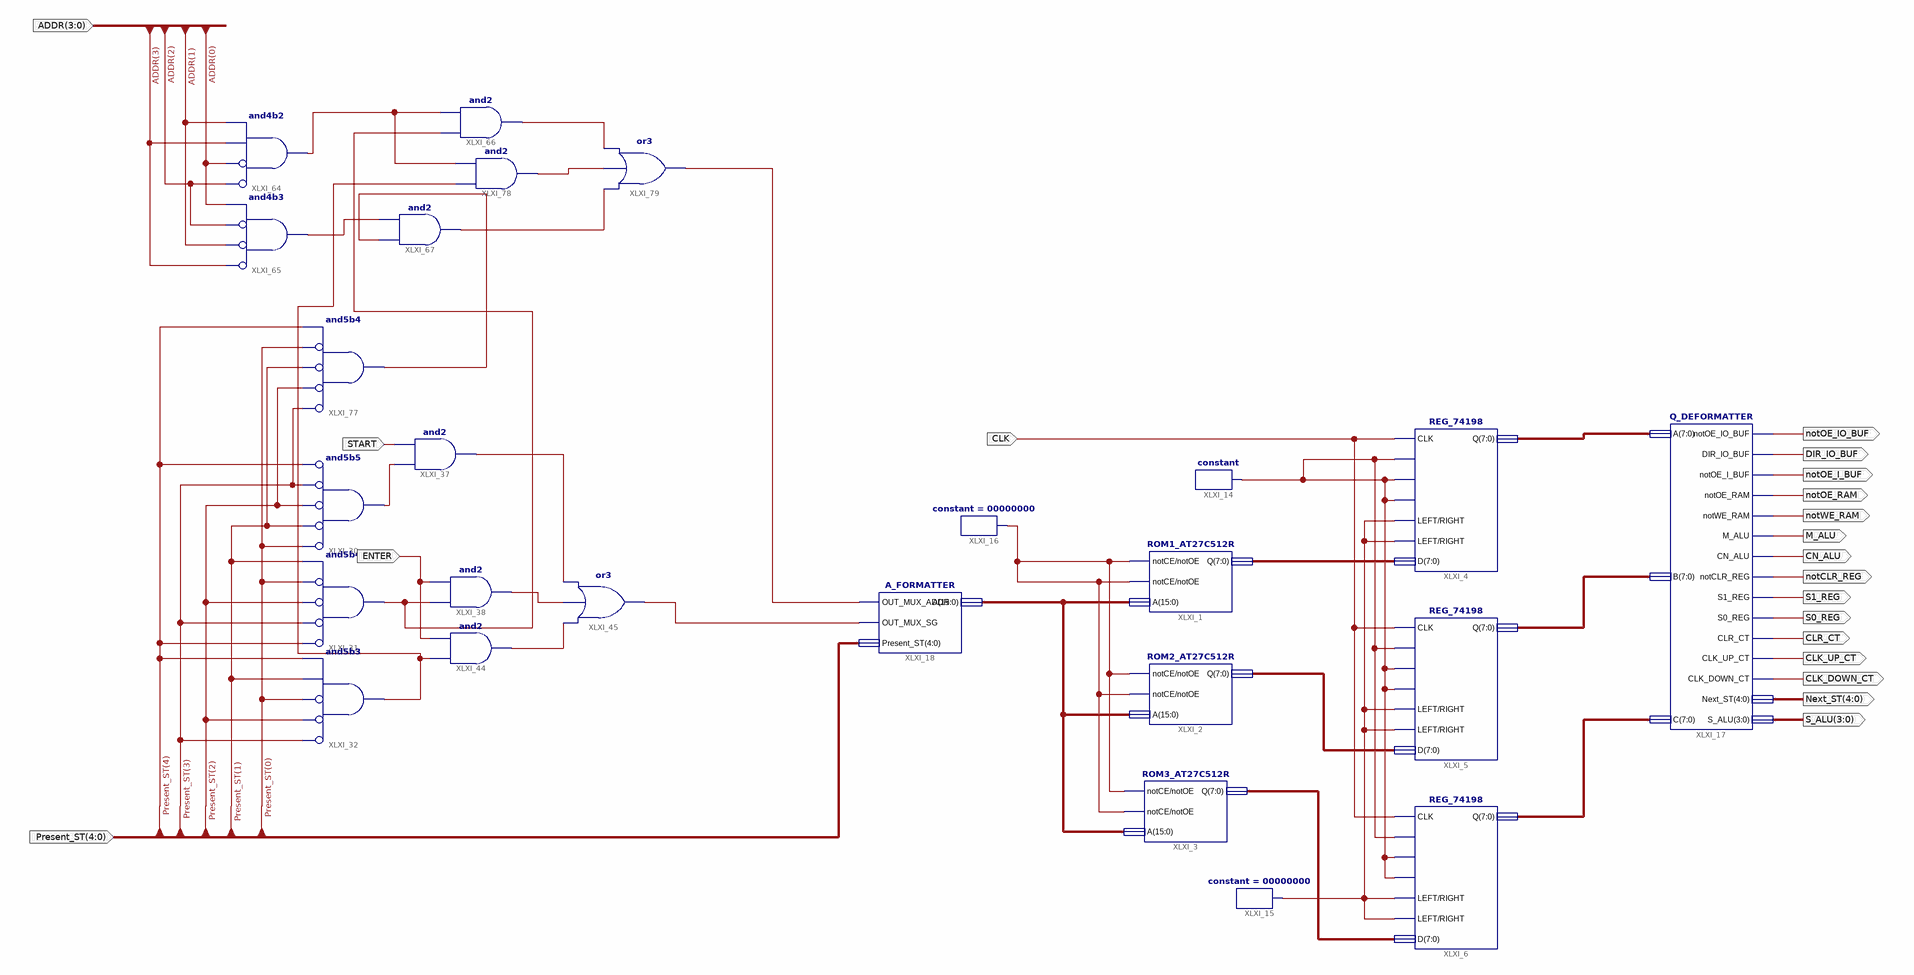
[diagram p0: schematic sheet 1]
// Xilinx ISE schematic CU.sch (spartan3a) as structural Verilog: 25 symbols, 20 ports
module CU (
  input  CLK,
  input  START,
  input  [4:0] Present_ST,
  input  ENTER,
  input  [3:0] ADDR,
  output notOE_IO_BUF,
  output DIR_IO_BUF,
  output notOE_I_BUF,
  output notOE_RAM,
  output notWE_RAM,
  output M_ALU,
  output CN_ALU,
  output notCLR_REG,
  output S1_REG,
  output S0_REG,
  output CLR_CT,
  output CLK_UP_CT,
  output CLK_DOWN_CT,
  output [4:0] Next_ST,
  output [3:0] S_ALU
);

  wire XLXN_9, XLXN_20, XLXN_22, XLXN_117, XLXN_134, XLXN_136, XLXN_137, XLXN_138, XLXN_140, XLXN_141,
       XLXN_206, XLXN_223, XLXN_224, XLXN_225, XLXN_226, XLXN_227, XLXN_228;
  wire [7:0] XLXN_3, XLXN_4, XLXN_5, XLXN_30, XLXN_31, XLXN_33;
  wire [15:0] XLXN_2;

  ROM1_AT27C512R XLXI_1 (.notCE(XLXN_9), .notOE(XLXN_9), .A(XLXN_2), .Q(XLXN_3));
  ROM2_AT27C512R XLXI_2 (.notCE(XLXN_9), .notOE(XLXN_9), .A(XLXN_2), .Q(XLXN_4));
  ROM3_AT27C512R XLXI_3 (.notCE(XLXN_9), .notOE(XLXN_9), .A(XLXN_2), .Q(XLXN_5));
  REG_74198 XLXI_4 (
    .CLK(CLK), .notCLR(XLXN_22), .S1(XLXN_22), .S0(XLXN_22), .LEFT(XLXN_20), .RIGHT(XLXN_20), .D(XLXN_3),
    .Q(XLXN_30));
  REG_74198 XLXI_5 (
    .CLK(CLK), .notCLR(XLXN_22), .S1(XLXN_22), .S0(XLXN_22), .LEFT(XLXN_20), .RIGHT(XLXN_20), .D(XLXN_4),
    .Q(XLXN_31));
  REG_74198 XLXI_6 (
    .CLK(CLK), .notCLR(XLXN_22), .S1(XLXN_22), .S0(XLXN_22), .LEFT(XLXN_20), .RIGHT(XLXN_20), .D(XLXN_5),
    .Q(XLXN_33));
  constant XLXI_14 (.O(XLXN_22));
  constant #(.CValue("00000000")) XLXI_15 (.O(XLXN_20));
  constant #(.CValue("00000000")) XLXI_16 (.O(XLXN_9));
  Q_DEFORMATTER XLXI_17 (
    .A(XLXN_30), .B(XLXN_31), .C(XLXN_33), .notOE_IO_BUF(notOE_IO_BUF), .DIR_IO_BUF(DIR_IO_BUF),
    .notOE_I_BUF(notOE_I_BUF), .notOE_RAM(notOE_RAM), .notWE_RAM(notWE_RAM), .M_ALU(M_ALU), .CN_ALU(CN_ALU),
    .notCLR_REG(notCLR_REG), .S1_REG(S1_REG), .S0_REG(S0_REG), .CLR_CT(CLR_CT), .CLK_UP_CT(CLK_UP_CT),
    .CLK_DOWN_CT(CLK_DOWN_CT), .Next_ST(Next_ST), .S_ALU(S_ALU));
  A_FORMATTER XLXI_18 (.OUT_MUX_ADDR(XLXN_228), .OUT_MUX_SG(XLXN_141), .Present_ST(Present_ST), .A(XLXN_2));
  and XLXI_31 (XLXN_134, ~Present_ST[4], ~Present_ST[3], ~Present_ST[2], ~Present_ST[0], Present_ST[1]);  // and5b4
  and XLXI_30 (XLXN_117, ~Present_ST[0], ~Present_ST[1], ~Present_ST[2], ~Present_ST[3], ~Present_ST[4]);  // and5b5
  and XLXI_32 (XLXN_136, ~Present_ST[3], ~Present_ST[2], ~Present_ST[0], Present_ST[1], Present_ST[4]);  // and5b3
  and XLXI_37 (XLXN_137, XLXN_117, START);
  and XLXI_38 (XLXN_138, XLXN_134, ENTER);
  and XLXI_44 (XLXN_140, XLXN_136, ENTER);
  or XLXI_45 (XLXN_141, XLXN_140, XLXN_138, XLXN_137);
  and XLXI_64 (XLXN_223, ~ADDR[2], ~ADDR[0], ADDR[3], ADDR[1]);  // and4b2
  and XLXI_65 (XLXN_206, ~ADDR[3], ~ADDR[1], ~ADDR[2], ADDR[0]);  // and4b3
  and XLXI_66 (XLXN_225, XLXN_134, XLXN_223);
  and XLXI_67 (XLXN_227, XLXN_224, XLXN_206);
  and XLXI_77 (XLXN_224, ~Present_ST[3], ~Present_ST[2], ~Present_ST[1], ~Present_ST[0], Present_ST[4]);  // and5b4
  and XLXI_78 (XLXN_226, XLXN_136, XLXN_223);
  or XLXI_79 (XLXN_228, XLXN_227, XLXN_226, XLXN_225);
endmodule
